# Altium project PCB_Project.PrjPcb
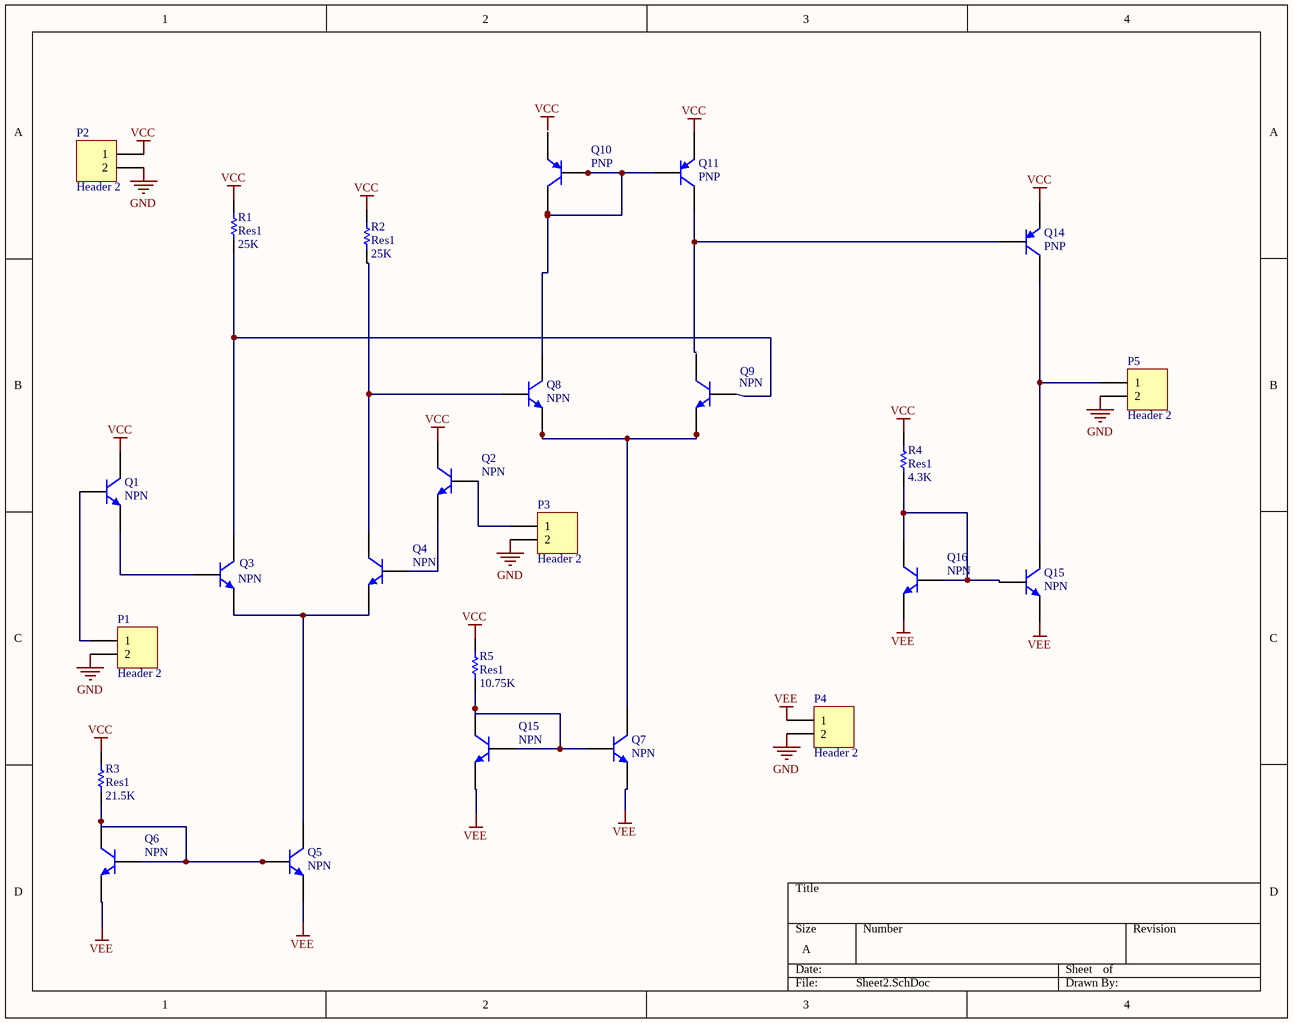
[diagram p0: Sheet2.SchDoc]
1 sheet, 25 parts. Net scope: global (net labels, ports and power ports of the same name join across sheets).
Board file: PCB1.PcbDoc

## Sheet Sheet2.SchDoc
size A

### Parts
(Parts that share a designator on the sheet are numbered #1, #2 ... from top to bottom, then left to right.)
P1  Header 2  [HDR1X2]
P2  Header 2  [HDR1X2]
P3  Header 2  [HDR1X2]
P4  Header 2  [HDR1X2]
P5  Header 2  [HDR1X2]
Q1  NPN  [TO-226-AA]
Q2  NPN  [TO-226-AA]
Q3  NPN  [TO-226-AA]
Q4  NPN  [TO-226-AA]
Q5  NPN  [TO-226-AA]
Q6  NPN  [TO-226-AA]
Q7  NPN  [TO-226-AA]
Q8  NPN  [TO-226-AA]
Q9  NPN  [TO-226-AA]
Q10  PNP  [SOT-23B_N]
Q11  PNP  [SOT-23B_N]
Q14  PNP  [SOT-23B_N]
Q15#1  NPN  [TO-226-AA]
Q15#2  NPN  [TO-226-AA]
Q16  NPN  [TO-226-AA]
R1  Res1  value 25K  [AXIAL-0.3]
R2  Res1  value 25K  [AXIAL-0.3]
R3  Res1  value 21.5K  [AXIAL-0.3]
R4  Res1  value 4.3K  [AXIAL-0.3]
R5  Res1  value 10.75K  [AXIAL-0.3]

### Nets
GND: P1.2 P2.2 P3.2 P4.2 P5.2
VCC: P2.1 Q1.1(C) Q2.1(C) Q11.3(E) Q14.3(E) R1.2 R2.2 R3.2 R4.2 R5.2
VEE: P4.1 Q5.3(E) Q6.3(E) Q7.3(E) Q15#1.3(E) Q15#2.3(E) Q16.3(E)
NetP1_1: P1.1 Q1.2(B)
NetP3_1: P3.1 Q2.2(B)
NetP5_1: P5.1 Q14.1(C) Q15#1.1(C)
NetQ1_3: Q1.3(E) Q3.2(B)
NetQ2_3: Q2.3(E) Q4.2(B)
NetQ3_1: Q3.1(C) Q9.2(B) R1.1
NetQ3_3: Q3.3(E) Q4.3(E) Q5.1(C)
NetQ4_1: Q4.1(C) Q8.2(B) R2.1
NetQ5_2: Q5.2(B) Q6.1(C) Q6.2(B) R3.1
NetQ7_1: Q7.1(C) Q8.3(E) Q9.3(E)
NetQ7_2: Q7.2(B) Q15#2.1(C) Q15#2.2(B) R5.1
NetQ8_1: Q8.1(C) Q10.1(C) Q10.2(B) Q11.2(B)
NetQ11_1: Q11.1(C) Q14.2(B)
NetQ15#1_2: Q15#1.2(B) Q16.1(C) Q16.2(B) R4.1

Not connected (* = marked no-connect by the designer): Q9 1(C); Q10 3(E)

### Notes on the sheet
- Labels drawn without touching a wire or pin: VCC

### Library data of the parts
P1-P5 = Header 2: Header, 2-Pin; LatestRevisionDate: 17-Jul-2002; LatestRevisionNote: Re-released for DXP Platform.; Publisher: Altium Limited
Q1-Q9 Q15#1 Q15#2 Q16 = NPN: NPN Bipolar Transistor; Published: 8-Jun-2000; LatestRevisionDate: 17-Jul-2002; LatestRevisionNote: Re-released for DXP Platform.; PackageReference: TO-226-AA; Publisher: Altium Limited; PackageDescription: TO, Flat Index; 3 In-Line, Axial Leads; Body Dia. 4.8mm; Leads 0.55 x 0.51 mm (max); Code_JEDEC: TO-226-AA
Q10 Q11 Q14 = PNP: PNP Bipolar Transistor; Published: 8-Jun-2000; LatestRevisionDate: 29-May-2009; LatestRevisionNote: IPC-7351 Footprint Added.; PackageVersion: Aug-1999; PackageReference: SOT-23B; Publisher: Altium Limited; PackageDescription: 3-Pin SOT-23 Package 0.95 mm Pitch, 2.4 mm Lead Span
R1-R5 = Res1: Resistor; Published: 8-Jun-2000; LatestRevisionDate: 17-Jul-2002; LatestRevisionNote: Re-released for DXP Platform.; PackageReference: AXIAL-0.3; Publisher: Altium Limited; PackageDescription: Axial Device, Thru-Hole; 2 Leads; 0.3 in Pin Spacing